# EAGLE schematic jetsonSerialBuffer (EAGLE 6.5.0)
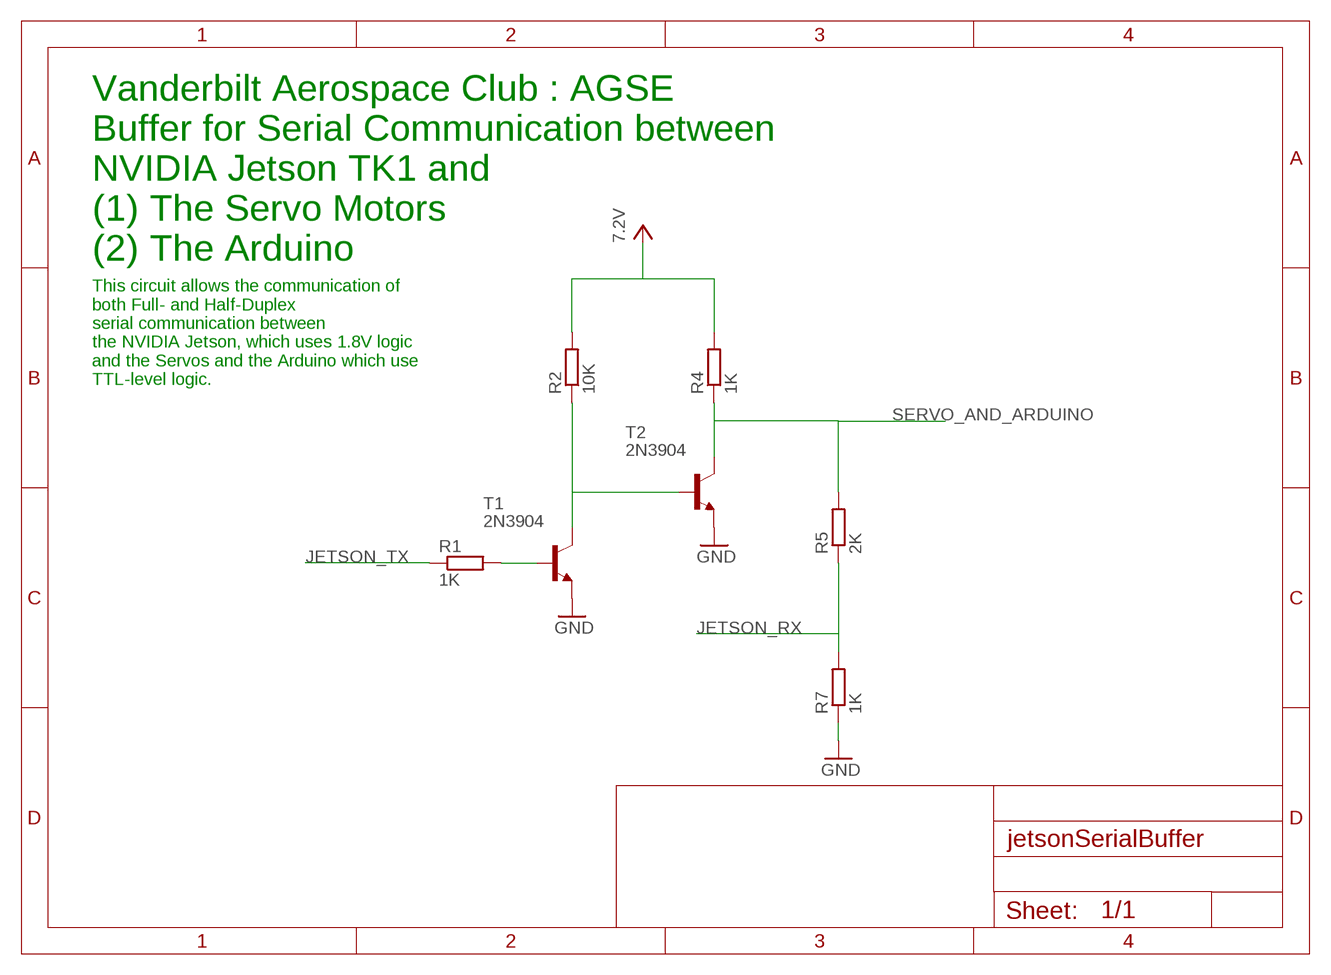
[diagram p0: schematic, sheet 1]

## Parts
R1  1K  R-EU_0309/10  [0309/10]
R2  10K  R-EU_0309/10  [0309/10]
R4  1K  R-EU_0309/10  [0309/10]
R5  2K  R-EU_0309/10  [0309/10]
R7  1K  R-EU_0309/10  [0309/10]
T1  2N3904  [TO92]
T2  2N3904  [TO92]

## Nets
GND: R7.1 T1.3(E) T2.3(E)
JETSON_RX: R5.1 R7.2
JETSON_TX: R1.1
N$1: R1.2 T1.2(B)
N$3: R2.1 T1.1(C) T2.2(B)
SERVO_AND_ARDUINO: R4.1 R5.2 T2.1(C)
VCC: R2.2 R4.2 ; supply symbol labelled 7.2V

## Notes on the sheet
- Vanderbilt Aerospace Club : AGSE 
  Buffer for Serial Communication between
  NVIDIA Jetson TK1 and
  (1) The Servo Motors
  (2) The Arduino
- This circuit allows the communication of
  both Full- and Half-Duplex
  serial communication between 
  the NVIDIA Jetson, which uses 1.8V logic
  and the Servos and the Arduino which use
  TTL-level logic.

## Library data of the parts
R1 R2 R4 R5 R7 = resistor:R-EU_: RESISTOR, European symbol
T1 T2 = transistor:2N3904: NPN TRANSISTOR